# Altium schematic sheet Controlador de velocidad - Placa fuente v2.SchDoc
size A4
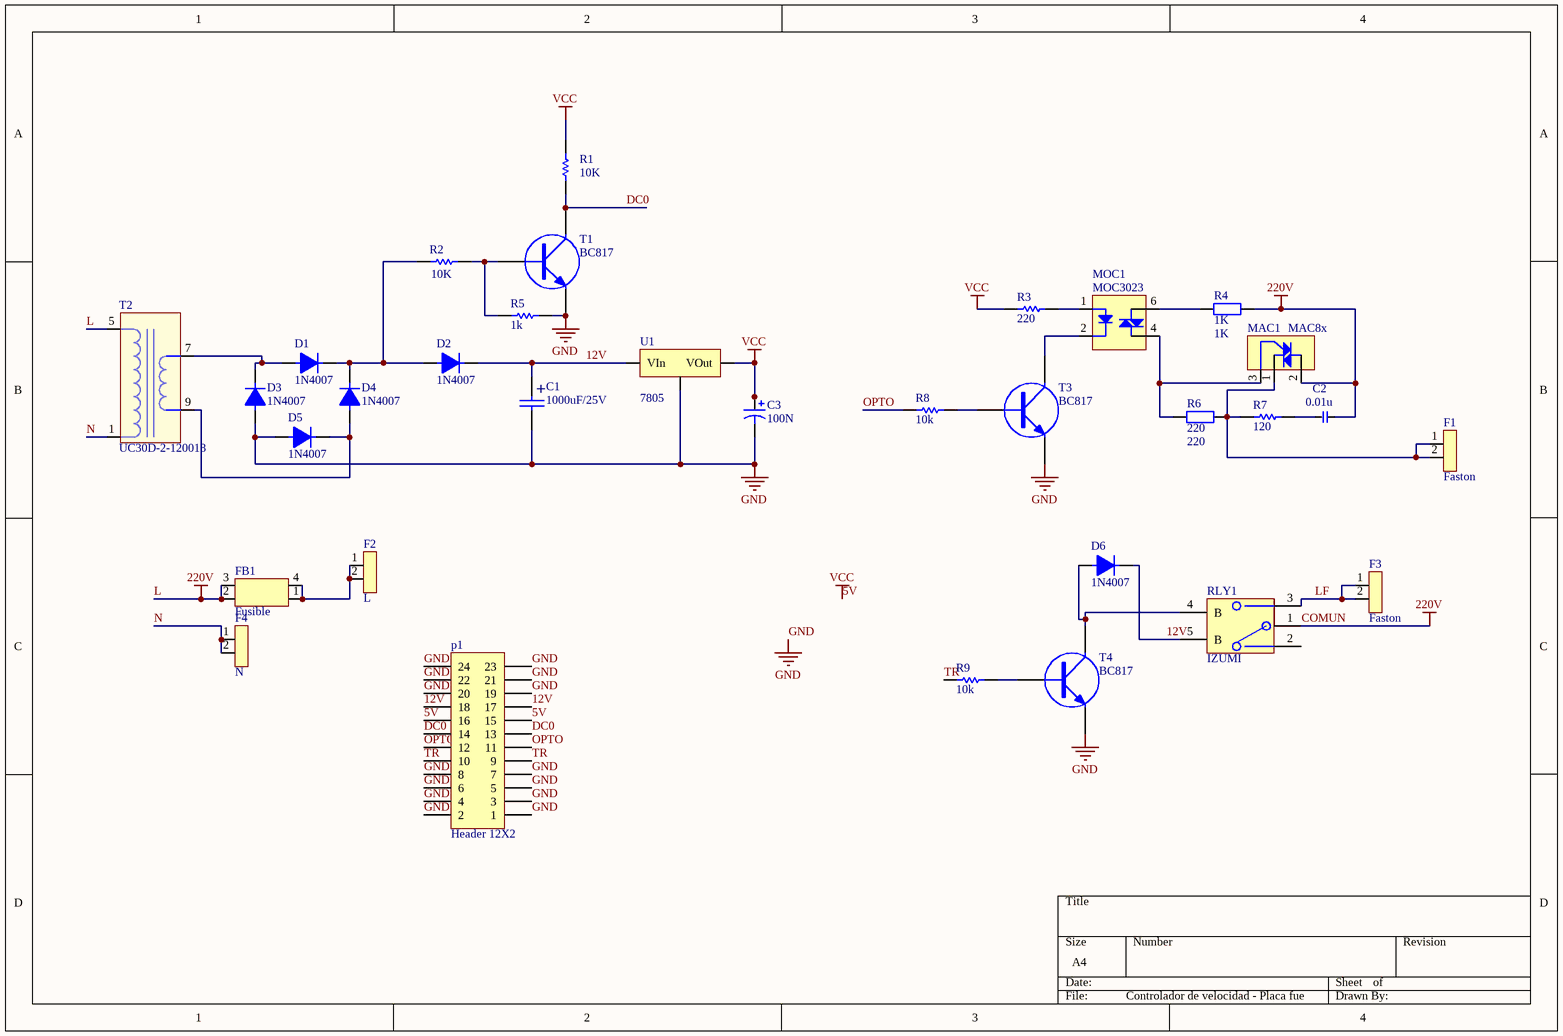
[diagram p0: Controlador de velocidad - Placa fuente v2.SchDoc]

## Parts
C1  1000uF/25V  [CAP300RP]
C2  0.01u  [AXIAL-0.4]
C3  100N  [C0805]
D1  1N4007  [DO41]
D2  1N4007  [DO41]
D3  1N4007  [DO41]
D4  1N4007  [DO41]
D5  1N4007  [DO41]
D6  1N4007  [DO41]
F1  Faston  [Faston_V]
F2  L  [Faston_V]
F3  Faston  [Faston_V]
F4  N  [Faston_V]
FB1  Fusible  [Porta_fuse_2]
MAC1  MAC8x  [TO-220_vert]
MOC1  MOC3023  [4N33]
p1  Header 12X2  [HDR2X12]
R1  10K  [0805]
R2  10K  [0805]
R3  220  [0805]
R4  1K  [AXIAL-0.4]
R5  1k  [0805]
R6  220  [AXIAL-0.4]
R7  120  [RES400]
R8  10k  [0805]
R9  10k  [0805]
RLY1  IZUMI  [Relay NT73-2]
T1  BC817  [SOT23]
T2  UC30D-2-120018  [Trafo_220_12_1]
T3  BC817  [SOT23]
T4  BC817  [SOT23]
U1  7805  [TO-220 V]

## Nets
5V: C3.1 p1.15 p1.16 R1.2 R3.1 U1.3(VOut)  [also labelled VCC]
COMUN: C2.1 FB1.2 FB1.3 MAC1.2(MT2) R4.2 RLY1.1(C) T2.5  [also labelled 220V, L]
GND: C1.2 C3.2 D3.1 D5.1 p1.1 p1.2 p1.3 p1.4 p1.5 p1.6 p1.7 p1.8 p1.19 p1.20 p1.21 p1.22 p1.23 p1.24 R5.2 T1.3(E) T3.3(E) T4.3(E) U1.2(GND)
12V: C1.1 D2.2 D6.2 p1.17 p1.18 RLY1.5(B) U1.1(VIn)
DC0: p1.13 p1.14 R1.1 T1.2(C)
LF: F3.1 F3.2 RLY1.3(NA)
N: F4.1 F4.2 T2.1
OPTO: p1.11 p1.12 R8.1
TR: p1.9 p1.10 R9.1
NetC2_2: C2.2 R7.1
NetD1_1: D1.1 D3.2 T2.7
NetD1_2: D1.2 D2.1 D4.2 R2.1
NetD4_1: D4.1 D5.2 T2.9
NetD6_1: D6.1 RLY1.4(B) T4.2(C)
NetF1_1: F1.1 F1.2 MAC1.1(MT1) R6.2 R7.2
NetF2_1: F2.1 F2.2 FB1.1 FB1.4
NetMAC1_3: MAC1.3(G) MOC1.4 R6.1
NetMOC1_1: MOC1.1 R3.2
NetMOC1_2: MOC1.2 T3.2(C)
NetMOC1_6: MOC1.6 R4.1
NetR2_2: R2.2 R5.1 T1.1(B)
NetR8_2: R8.2 T3.1(B)
NetR9_2: R9.2 T4.1(B)

Not connected (* = marked no-connect by the designer): RLY1 2(NC)

## Notes on the sheet
- (in symbol CAPPOL) +

## Library data of the parts
C1 = CAPPOL
C2 = CAP_MINI_NPOL: Part Field 1: 0; Part Field 10: 1000u; Text Field1: 20; Text Field2: 10; Part Field 2: 0; Part Field 3: 0; Part Field 4: 0; Part Field 5: 1; Part Field 6: 0; Part Field 7: 1u; Part Field 8: 1u; Part Field 9: 500u
C3 = Cap Pol3: Polarized Capacitor (Surface Mount); Published: 8-Jun-2000; LatestRevisionDate: 17-Jul-2002; LatestRevisionNote: Re-released for DXP Platform.; PackageReference: C0805; Publisher: Altium Limited
D1-D6 = DIODO
F1-F4 = FastonX1
FB1 = Porta_fuse_1
p1 = Header 12X2: Header, 12-Pin, Dual row; LatestRevisionDate: 17-Jul-2002; LatestRevisionNote: Re-released for DXP Platform.; Publisher: Altium Limited
R1-R3 R5 R7-R9 = RES
R4 R6 = Res2: Resistor; Published: 8-Jun-2000; LatestRevisionDate: 17-Jul-2002; LatestRevisionNote: Re-released for DXP Platform.; PackageReference: AXIAL-0.4; Publisher: Altium Limited
  R4: Value: 1K
  R6: Value: 220
RLY1 = RELE_SPSP
T1 T3 T4 = TRANSISTOR NPN
T2 = TRAFO_220_12_1: Text Field1: 30; Text Field2: 40
U1 = 78XX: REGULDOR POSITIVO